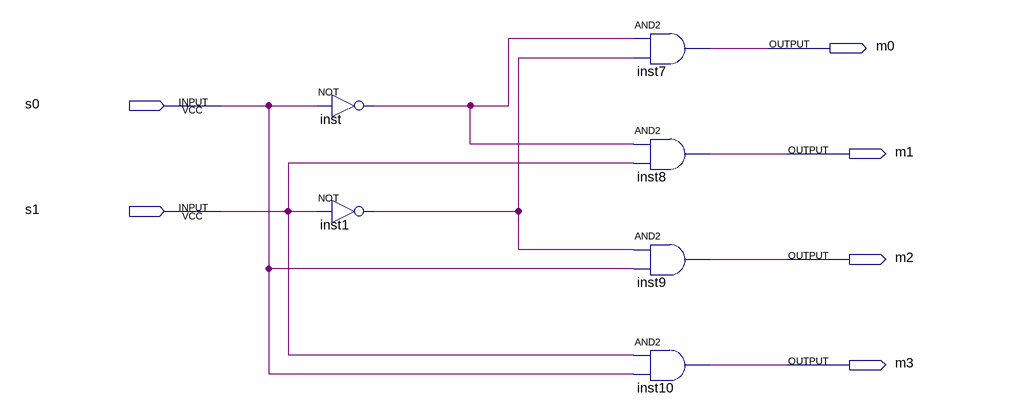
[diagram p0: schematic sheet]
// Quartus schematic decoder.bdf as structural Verilog: 6 symbols, 6 pins
module decoder (
  input  s0,
  input  s1,
  output m0,
  output m1,
  output m2,
  output m3
);

  wire inst1_out, inst_out;

  not inst (inst_out, s0);
  not inst1 (inst1_out, s1);
  and inst7 (m0, inst_out, inst1_out);
  and inst8 (m1, inst_out, s1);
  and inst9 (m2, inst1_out, s0);
  and inst10 (m3, s1, s0);
endmodule
